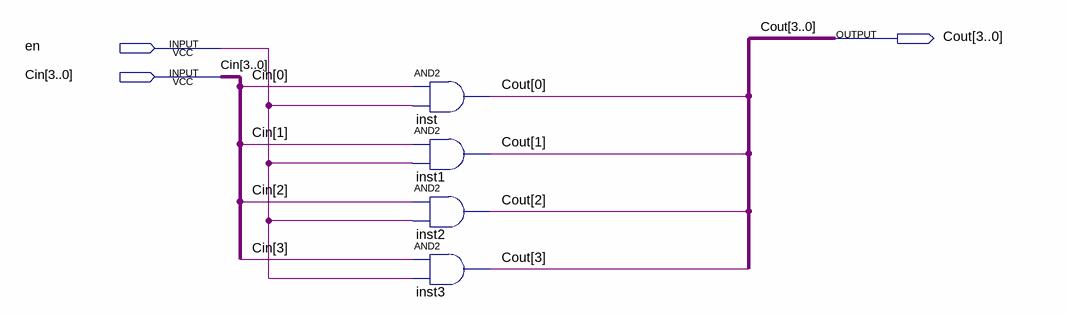
[diagram p0: schematic sheet]
// Quartus schematic fourbitAnd.bdf as structural Verilog: 4 symbols, 3 pins
module fourbitAnd (
  input  en,
  input  [3:0] Cin,
  output [3:0] Cout
);

  and inst (Cout[0], Cin[0], en);
  and inst1 (Cout[1], Cin[1], en);
  and inst2 (Cout[2], Cin[2], en);
  and inst3 (Cout[3], Cin[3], en);
endmodule
